# EAGLE design untitled (EAGLE 9.2.0)
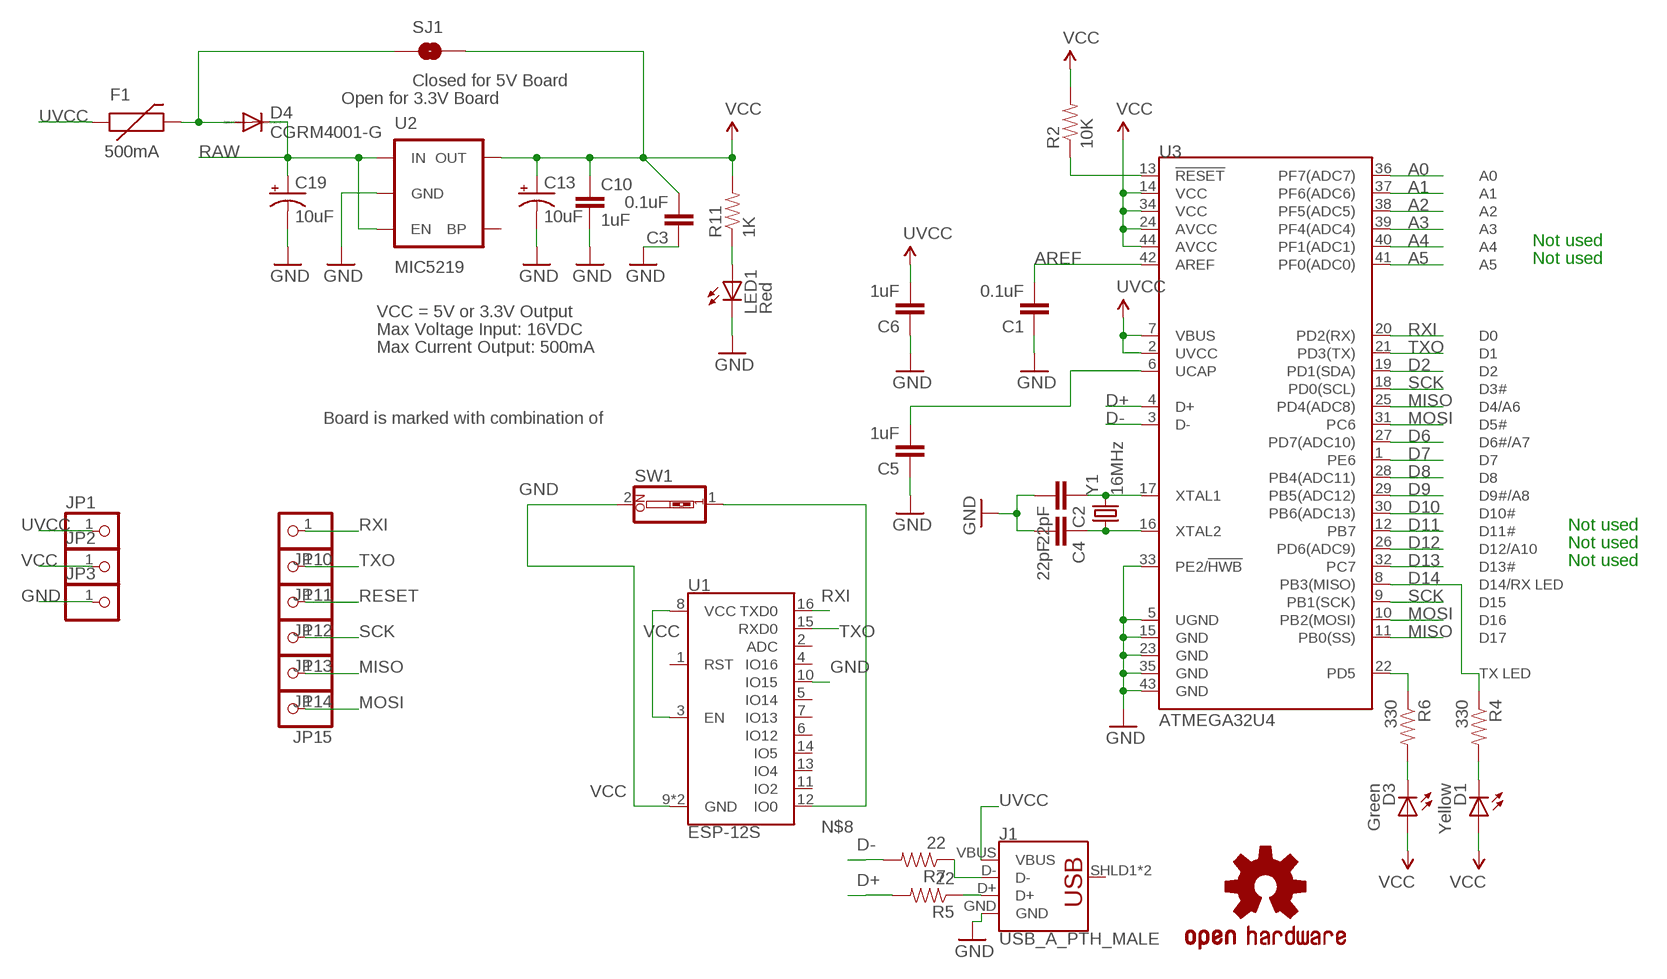
[diagram p0: schematic, sheet 1]

## Parts
C1  0.1uF  CAP0603-CAP  [0603-CAP]
C2  22pF  CAP0603-CAP  [0603-CAP]
C3  0.1uF  CAP0603-CAP  [0603-CAP]
C4  22pF  CAP0603-CAP  [0603-CAP]
C5  1uF  CAP0603-CAP  [0603-CAP]
C6  1uF  CAP0603-CAP  [0603-CAP]
C10  1uF  CAP0603-CAP  [0603-CAP]
C13  10uF  CAP_POL1206  [EIA3216]
C19  10uF  CAP_POL1206  [EIA3216]
D1  Yellow  LED0603  [LED-0603]
D3  Green  LED0603  [LED-0603]
D4  CGRM4001-G  [SOD-123_MINI-SMA]
F1  500mA  PTCSMD  [PTC-1206]
J1  USB_A_PTH_MALE  [USB-A-H]
JP1  PINHD-1X1  [1X01]
JP2  PINHD-1X1  [1X01]
JP3  PINHD-1X1  [1X01]
JP10  PINHD-1X1  [1X01]
JP11  PINHD-1X1  [1X01]
JP12  PINHD-1X1  [1X01]
JP13  PINHD-1X1  [1X01]
JP14  PINHD-1X1  [1X01]
JP15  PINHD-1X1  [1X01]
LED1  Red  LED0603  [LED-0603]
R2  10K  RESISTOR0603-RES  [0603-RES]
R4  330  RESISTOR0603-RES  [0603-RES]
R5  22  RESISTOR0603-RES  [0603-RES]
R6  330  RESISTOR0603-RES  [0603-RES]
R7  22  RESISTOR0603-RES  [0603-RES]
R11  1K  RESISTOR0603-RES  [0603-RES]
SJ1  Closed for 5V Board  SOLDERJUMPERNC  [SJ_2S]
SW1  SW_DIP-1  [EDG-01]
U1  ESP-12S  [ESP-12S]
U2  MIC5219  V_REG_LDOSMD  [SOT23-5]
U3  ATMEGA32U4  ATMEGA32U4OUTFAKES  [QFN-44-NOPAD_1:1-OUTFAKES]
U$3  OSHW-LOGOS  [OSHW-LOGO-S]
Y1  16MHz  CRYSTAL5X3  [CRYSTAL-SMD-5X3]

## Nets
A0: U3.36(PF7(ADC7))
A1: U3.37(PF6(ADC6))
A2: U3.38(PF5(ADC5))
A3: U3.39(PF4(ADC4))
A4: U3.40(PF1(ADC1))
A5: U3.41(PF0(ADC0))
AREF: C1.2 U3.42(AREF)
D2: U3.19(PD1(SDA))
D6: U3.27(PD7(ADC10))
D7: U3.1(PE6)
D8: U3.28(PB4(ADC11))
D9: U3.29(PB5(ADC12))
D10: U3.30(PB6(ADC13))
D11: U3.12(PB7)
D12: U3.26(PD6(ADC9))
D13: U3.32(PC7)
D14: R4.1 U3.8(PB3(MISO))
D+: R5.2 U3.4(D+)
D-: R7.2 U3.3(D-)
GND [vcc]: C1.1 C2.2 C3.1 C4.2 C5.1 C6.1 C10.2 C13.C(-) C19.C(-) J1.GND JP3.1 LED1.C SW1.2 U1.9(GND) U1.10(IO15) U1.P$1(GND) U2.2(GND) U3.5(UGND) U3.15(GND) U3.23(GND) U3.33(PE2/!HWB) U3.35(GND) U3.43(GND)
MISO: JP14.1 U3.11(PB0(SS)) U3.25(PD4(ADC8))
MOSI: JP15.1 U3.10(PB2(MOSI)) U3.31(PC6)
N$1: C4.1 U3.16(XTAL2) Y1.1
N$2: C2.1 U3.17(XTAL1) Y1.3
N$3: D4.A F1.2 SJ1.1
N$4: C5.2 U3.6(UCAP)
N$5: D1.C R4.2
N$7: D3.C R6.2
N$8: SW1.1 U1.12(IO0)
N$9: J1.D+ R5.1
N$10: J1.D- R7.1
N$38: LED1.A R11.1
RAW [vcc]: C19.A(+) D4.C U2.1(IN) U2.3(EN)
RESET: JP12.1 R2.1 U3.13(!RESET)
RXI: JP10.1 U1.16(TXD0) U3.20(PD2(RX))
SCK: JP13.1 U3.9(PB1(SCK)) U3.18(PD0(SCL))
TXLED: R6.1 U3.22(PD5)
TXO: JP11.1 U1.15(RXD0) U3.21(PD3(TX))
UVCC: C6.2 F1.1 J1.VBUS JP1.1 U3.2(UVCC) U3.7(VBUS)
VCC: C3.2 C10.1 C13.A(+) D1.A D3.A JP2.1 R2.2 R11.2 SJ1.2 U1.3(EN) U1.8(VCC) U2.5(OUT) U3.14(VCC) U3.24(AVCC) U3.34(VCC) U3.44(AVCC)
Unconnected: J1.SHLD1(SHIELD) J1.SHLD2(SHIELD) U1.1(RST) U1.2(ADC) U1.4(IO16) U1.5(IO14) U1.6(IO12) U1.7(IO13) U1.11(IO2) U1.13(IO4) U1.14(IO5) U2.4(BP)

## Notes on the sheet
- Open for 3.3V Board
- Not used
- Not used
- VCC = 5V or 3.3V Output
- Max Voltage Input: 16VDC
- Max Current Output: 500mA
- Board is marked with combination of
- Not used
- Not used
- Not used

## Library data of the parts
C1-C6 C10 = SparkFun:CAP: Capacitor Standard 0603 ceramic capacitor, and 0.1" leaded capacitor.
C13 C19 = SparkFun:CAP_POL: Capacitor Polarized These are standard SMD and PTH capacitors. Normally 10uF, 47uF, and 100uF in electrolytic and tantalum varieties. Always verify the external diameter of the through hole cap, it varies with capacity, voltage, and manufacturer. The EIA devices should be standard.
D1 D3 LED1 = SparkFun:LED: LEDs Standard schematic elements and footprints for 5mm, 3mm, 1206, and 0603 sized LEDs. 5mm - Spark Fun Electronics SKU : COM-00529 (and others)
D4 = diode:CGRM400*-G: Molded plasitc,JEDEC SOD-123/Mini SMA Source: Comchip CGRM4001-G.pdf
F1 = SparkFun:PTC: Resettable Fuse PTC Resettable Fuse. Spark Fun Electronics SKU : COM-08357
J1 = SparkFun-Connectors:USB_A: USB-A Connector Male and female variants, as well as PTH and SMT variants SparkFun Products: SparkFun XBee Explorer Dongle <https://www.sparkfun.com/products/11697> PTH Male SparkFun MicroView-USB Programmer <https://www.sparkfun.com/products/12924> SMT Male SparkFun USB Type A Female Breakout <https://www.sparkfun.com/products/12700> SMT Female; PROD_ID: CONN-08367; SF_ID: PRT-00437
JP1-JP3 JP10-JP15 = pinhead:PINHD-1X1: PIN HEADER
R2 R4-R7 R11 = SparkFun:RESISTOR: Resistor Basic schematic elements and footprints for 0603, 1206, and PTH resistors.
SJ1 = SparkFun:SOLDERJUMPER: Solder Jumper Standard SMD solder jumper. Used to automate production. Two varients : Normally Open and Normally Closed are the same, but have different paste layers. NC will have a large amount of paste and should jumper during reflow.; SPICEPREFIX: D
SW1 = special:SW_DIP-1: DIP SWITCH
U1 = SparkFun-RF:ESP-12S: AI-Thinker ESP-12S ESP-12S WiFi module is developed by AI-Thinker Co.,Ltd, core processor ESP8266 in smaller sizes of the module encapsulates Tensilica L106 integrates industry-leading ultra low power 32-bit MCU micro, with the 16-bit short mode, clock speed support 80 MHz, 160 MHz, supports the RTOS, integrated Wi-Fi MAC/BB/RF/PA/LNA, on-board antennas.; PROD_ID: IC-14115
U2 = SparkFun:V_REG_LDO: Voltage Regulator LDO Standard 150mA LDO voltage regulator in SOT-23 layout. Micrel part MIC5205. BP (by-pass) pin is used to lower output noise with 470pF cap.
U3 = Testing:ATMEGA32U4: Atmel 44-pin 8-bit Microcontroller with 32KBytes of ISP Flash and USB Controller
U$3 = SparkFun:OSHW-LOGO: Open Source Hardware Logo This logo indicates the piece of hardware it is found on incorporates a OSHW license and/or adheres to the definition of open source hardware found here: http://freedomdefined.org/OSHW
Y1 = SparkFun:CRYSTAL: Crystals Various standard crystals. Proven footprints. Spark Fun Electronics SKU : COM-00534

## Net classes
0 default: width 0.203 mm

## Board
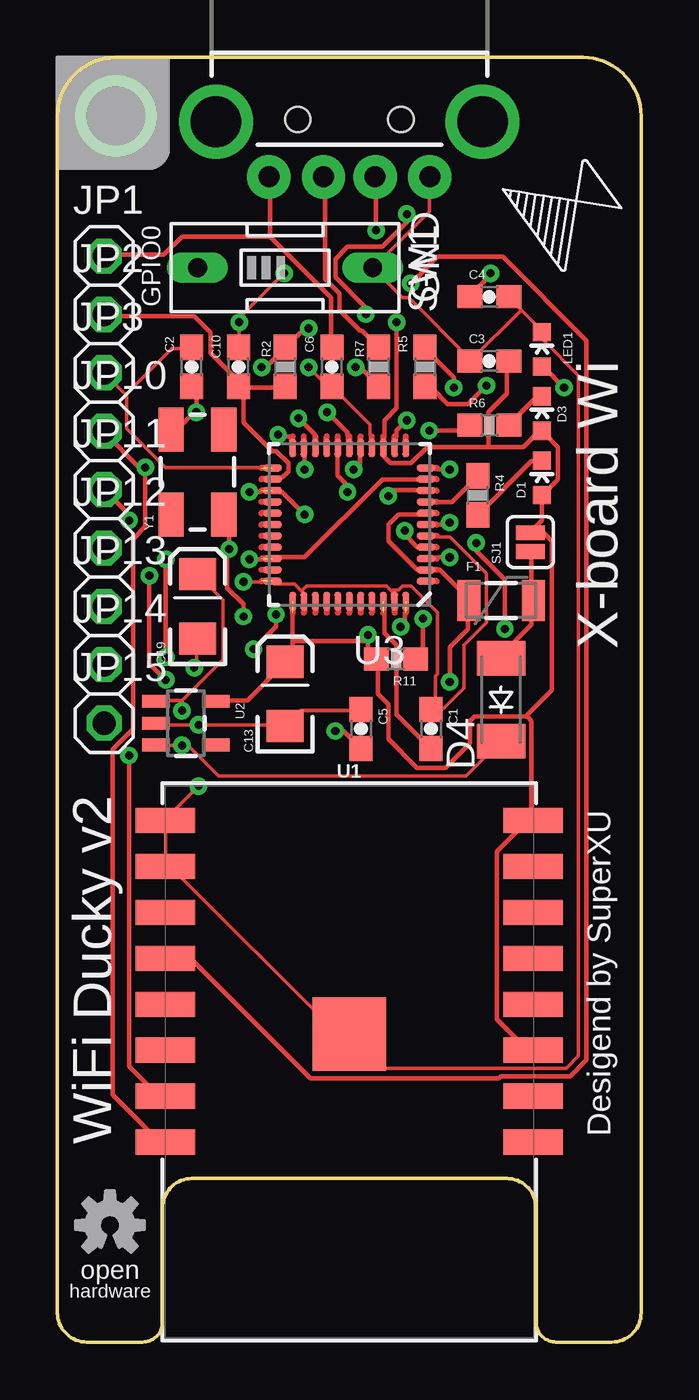
[diagram p1: board, top side]
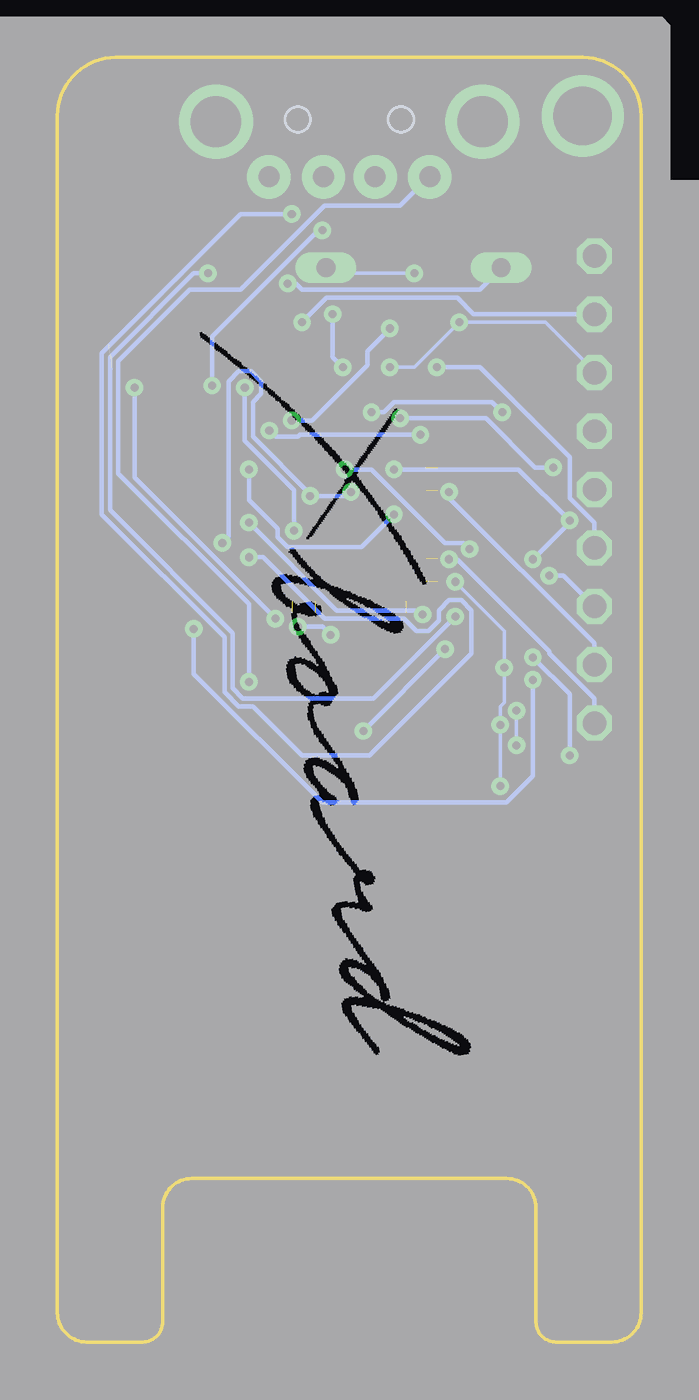
[diagram p2: board, bottom side, seen from below]

Size 25.4 x 55.88 mm. Coordinates in mm from the lower left corner, seen from the top.
Outline: 25.4,1.27 25.4,53.34 arc90 22.86,55.88 2.54,55.88 arc90 0,53.34 0,1.27 arc90 1.27,0 3.71,0 arc90 4.57,0.87 4.57,5.84 arc-90 5.84,7.11 19.56,7.11 arc-90 20.83,5.84 20.83,0.87 arc90 21.7,0 24.13,0 arc90 25.4,1.27
Copper layers (1*16): Top 0.035mm / dielectric 1.5mm / Bottom 0.035mm
Design rules "default *": minimum track width 6mil, minimum drill 0.35mm, track to track 6mil, track to pad 6mil, pad to pad 6mil, via to via 6mil, smd to smd 6mil, copper to edge 40mil, drill to drill 6mil, minimum pad ring 10mil, minimum via ring 8mil, stop-mask expansion 4mil, vias tented up to drill 0.35mm, thermal gap 10mil

### Footprints (pad centres in the part's own frame; a part is rotated, then mirrored left to right if it is on the bottom)
0603-CAP = smd 1.1 x 1: 1 -0.85,0; 2 0.85,0
EIA3216 = smd 1.4 x 1.6: A 1.4,0; C -1.4,0
LED-0603 = smd 0.8 x 0.8: A 0,-0.75; C 0,0.75
SOD-123_MINI-SMA = smd 1.5 x 2.1: A 1.8,0; C -1.8,0
PTC-1206 = smd 1 x 1.8: 1 -1.4,0; 2 1.4,0
USB-A-H = drill 0.914 pad 1.88: D+ 2.4,1.127; D- 2.4,-1.127; GND 2.4,3.5; VBUS 2.4,-3.5 | drill 2.2: SHLD1 0,-5.8; SHLD2 0,5.8 | hole 1.1: -0.1,2.25; -0.1,-2.25
1X01 = drill 1.016 octagon: 1 0,0
0603-RES = smd 1.1 x 1: 1 -0.85,0; 2 0.85,0
SJ_2S = smd 0.635 x 1.27: 1 -0.412,0; 2 0.412,0
EDG-01 = drill 0.813 long: 1 0,-3.81; 2 0,3.81
ESP-12S = smd 2.6 x 1.1: 1 -8,3.5; 2 -8,1.5; 3 -8,-0.5; 4 -8,-2.5; 5 -8,-4.5; 6 -8,-6.5; 7 -8,-8.5; 8 -8,-10.5; 9 8,-10.5; 10 8,-8.5; 11 8,-6.5; 12 8,-4.5; 13 8,-2.5; 14 8,-0.5; 15 8,1.5; 16 8,3.5 | smd 3.2 x 3.2: P$1 0,-1.2
SOT23-5 = smd 0.55 x 1.2: 1 -0.95,-1.3; 2 0,-1.3; 3 0.95,-1.3; 4 0.95,1.3; 5 -0.95,1.3
QFN-44-NOPAD_1:1-OUTFAKES = smd 0.8 x 0.3: 1 -3.337,2.465; 2 -3.337,1.972; 3 -3.337,1.479; 4 -3.337,0.986; 5 -3.337,0.493; 6 -3.337,0; 7 -3.337,-0.493; 8 -3.337,-0.986; 9 -3.337,-1.479; 10 -3.337,-1.972; 11 -3.337,-2.465; 23 3.337,-2.465; 24 3.337,-1.972; 25 3.337,-1.479; 26 3.337,-0.986; 27 3.337,-0.493; 28 3.337,0; 29 3.337,0.493; 30 3.337,0.986; 31 3.337,1.479; 32 3.337,1.972; 33 3.337,2.465 | smd 0.3 x 0.8: 12 -2.465,-3.337; 13 -1.972,-3.337; 14 -1.479,-3.337; 15 -0.986,-3.337; 16 -0.493,-3.337; 17 0,-3.337; 18 0.493,-3.337; 19 0.986,-3.337; 20 1.479,-3.337; 21 1.972,-3.337; 22 2.465,-3.337; 34 2.465,3.337; 35 1.972,3.337; 36 1.479,3.337; 37 0.986,3.337; 38 0.493,3.337; 39 0,3.337; 40 -0.493,3.337; 41 -0.986,3.337; 42 -1.479,3.337; 43 -1.972,3.337; 44 -2.465,3.337
CRYSTAL-SMD-5X3 = smd 1.9 x 1.1: 1 -1.85,-1.15; 2 1.85,-1.15; 3 1.85,1.15; 4 -1.85,1.15

### Placement (x,y rotation side)
C1  16.26,26.67 270 top
C2  5.84,42.42 90 top
C3  18.8,42.67 0 top
C4  18.8,45.47 0 top
C5  13.21,26.67 270 top
C6  11.94,42.42 90 top
C10  7.87,42.42 90 top
C13  9.91,28.19 90 top
C19  6.1,32 90 top
D1  21.08,37.59 0 top
D3  21.08,40.39 0 top
D4  19.3,27.94 90 top
F1  19.3,32.26 0 top
J1  12.7,53.09 270 top
JP1  2.03,47.24 0 top
JP2  2.03,44.7 0 top
JP3  2.03,42.16 0 top
JP10  2.03,39.62 0 top
JP11  2.03,37.08 0 top
JP12  2.03,34.54 0 top
JP13  2.03,32 0 top
JP14  2.03,29.46 0 top
JP15  2.03,26.92 0 top
LED1  21.08,43.18 0 top
R2  9.91,42.42 270 top
R4  18.29,36.83 270 top
R5  16,42.42 90 top
R6  18.8,39.88 0 top
R7  13.97,42.42 270 top
R11  14.73,29.72 180 top
SJ1  20.57,34.8 90 top
SW1  9.91,46.74 270 top
U1  12.7,12.19 180 top
U2  5.59,26.92 270 top
U3  12.7,35.56 180 top
U$3  2.29,5.08 0 top
Y1  6.1,37.85 90 top

### Tracks (layer width: path | path; a pad name or v marks a point on that pad's centre or on a via)
AREF  (1 unrouted)
  Top 0.203: 14.18,31.73 14.22,31.65 14.22,30.85 14.76,30.32 14.76,27.29 16.18,25.87 C1.2
D14
  Top 0.203: U3.8 16.62,36.54 17.16,36.54 18.22,37.6 R4.1
D+  (via drill 0.35)
  Top 0.203: v15.11,35.29 15.11,35.12 15.65,34.58 15.91,34.58 U3.4 | v17.25,41.52 17.25,41.96 16,43.2 R5.2
  Bottom 0.203: v15.11,35.29 15.11,37.07 17.25,39.2 v17.25,41.52
D-  (via drill 0.35)
  Top 0.203: v17.07,34.14 16.62,34.14 U3.3 | v15.2,49.07 15.2,48.72 14.13,47.65 12.62,47.65 12.09,47.12 12.09,46.32 13.42,44.98 v13.42,44.72 | v12.98,42.41 13.16,42.41 13.96,41.6 R7.2
  Bottom 0.203: v17.07,34.14 16.45,34.14 13.78,31.47 10.31,31.47 9.78,30.94 9.25,30.94 8.8,31.38 8.8,31.83 8.36,32.27 7.82,32.27 7.38,31.83 7.38,29.96 11.82,25.51 14.76,25.51 16.89,27.65 17.51,27.65 18.14,28.27 18.14,30.67 23.47,36.01 23.47,43.03 17.42,49.07 v15.2,49.07 | v13.42,44.72 13.42,42.85 v12.98,42.41
GND  (via drill 0.35)  (2 unrouted)
  Top 0.152: U3.15 13.6,39.47 13.6,39.92 12,41.52 C6.1 11.91,41.6 11.73,41.6 v10.94,42.41 | 2.98,41.2 2.04,42.14 JP3.1 | 2.98,41.2 3.02,41.16 3.02,39.74 4.71,38.05 8.8,38.05 8.87,38.02 | 2.98,41.2 4.98,43.2 5.78,43.2 C2.2 | C10.2 7.91,43.29 v7.91,44.36 7.91,44.54 v9.87,46.49 | 20.18,44.9 19.65,45.43 C4.2 | 20.18,44.9 21.07,44.01 LED1.C 21.16,43.92 21.16,43.56 22.67,42.05 22.67,12.45 22.14,11.91 14.13,11.91 12.71,13.34 U1.P$1 12.62,13.42 12.18,13.42 4.98,20.62 4.71,20.62 U1.10 4.71,20.71 4.71,22.67 U1.9 4.71,22.76 v6.13,24.18 | 20.18,44.9 C3.1 17.96,42.76 15.29,45.43 15.02,45.43 SW1.2 13.78,46.76 16.18,49.16 16.18,50.67 J1.GND | 10.62,32.67 10.31,32.98 9.42,32.98 U3.33 | 10.62,32.67 10.67,32.63 10.67,32.27 U3.35 | 14.54,32.67 14.31,32.89 10.85,32.89 10.62,32.67 | 14.54,32.67 14.58,32.63 14.58,32.27 U3.43 | 16.45,27.56 16.27,27.56 C1.1 16.45,27.56 | 16.45,27.56 16.8,27.56 17.69,28.45 17.69,30.32 18.67,31.29 18.67,33.43 17.07,35.03 16.62,35.03 U3.5 | 16.45,27.56 16.45,28.98 16.54,29.07 16.54,31.74 15.38,32.89 15.02,32.89 14.85,32.72 14.58,32.72 14.54,32.67 | C5.1 13.16,27.47 10.58,27.47 9.96,26.85 C13.C 9.87,26.85 v6.13,26.85 4.36,26.85 U2.2 | v5.96,29.34 6.04,29.43 6.04,30.58 C19.C | v8.09,33.07 8.8,33.07 8.87,33.09
  Bottom 0.152: JP3.1 2.04,42.23 4.18,44.36 v7.91,44.36 9.87,42.41 v10.94,42.41 | v9.87,46.49 13.51,46.49 13.69,46.67 SW1.2 | v6.13,24.18 v6.13,26.85 6.13,27.65 5.96,27.83 v5.96,29.34 5.96,30.94 v8.09,33.07
MISO  (via drill 0.35)  (1 unrouted)
  Top 0.203: v17.07,37.96 16.62,37.96 U3.11 | v10.76,36.01 9.78,36.98 9.42,36.98 U3.25 | v8.36,36.98 8.8,36.98 8.87,37.04
  Bottom 0.203: v17.07,37.96 17.07,36.63 15.82,35.38 15.82,35.03 15.38,34.58 12.18,34.58 v10.76,36.01 | v8.36,36.98 8.36,36.72 2.04,30.4 2.04,29.52 JP14.1
MOSI  (via drill 0.35)  (1 unrouted)
  Top 0.203: U3.10 15.91,37.52 14.13,37.52 10.76,34.14 9.42,34.14 U3.31 | v8.36,34.05 8.8,34.05 8.87,34.08
  Bottom 0.203: v8.36,34.05 8,34.05 4,30.05 4,29.96 2.04,28 2.04,26.94 JP15.1
N$1  (via drill 0.35)
  Top 0.203: v12.89,37.96 13.16,38.23 13.16,38.85 U3.16 | Y1.1 7.29,35.92 7.47,35.74 v7.47,34.49 7.38,34.49 7.38,32.8 8.09,32.09 v8.09,31.56 | v18.85,46.49 18.85,46.41 17.96,45.52 C4.1
  Bottom 0.203: v12.89,37.96 11.73,37.96 8.53,34.76 7.73,34.76 v7.47,34.49 | v18.85,46.49 19.47,46.49 23.11,42.85 23.11,36.18 17.78,30.85 17.78,28.45 17.34,28 11.65,28 v8.09,31.56
N$2  (via drill 0.35)
  Top 0.203: v11.73,40.45 12.62,39.56 12.62,39.47 U3.17 | C2.1 5.87,41.52 6.04,41.34 v6.04,40.45 5.96,40.45 5.25,39.74 4.98,39.74 Y1.3
  Bottom 0.203: v11.73,40.45 11.2,40.45 10.76,40.89 6.49,40.89 v6.04,40.45
N$3
  Top 0.203: SJ1.1 20.62,34.31 20.62,32.27 F1.2 20.62,32.18 20.62,31.2 19.38,29.96 19.38,29.78 D4.A
N$4  (via drill 0.35)
  Top 0.203: v17.07,35.65 16.98,35.56 U3.6 | v9.51,31.65 9.51,31.11 v8.53,30.14 | v12.09,26.58 12.45,26.58 13.16,25.87 C5.2
  Bottom 0.203: v17.07,35.65 13.25,31.83 9.69,31.83 v9.51,31.65 | v12.09,26.58 v8.53,30.14
N$5
  Top 0.203: D1.C 21.07,38.32 20.62,38.32 18.31,36.01 R4.2
N$6  (via drill 2.54)
  other vias: 2.54,53.34
N$7
  Top 0.203: D3.C 21.07,41.07 20.8,41.07 19.65,39.92 R6.2
N$8  (via drill 0.35)
  Top 0.203: v15.38,46.05 16.54,47.21 19.38,47.21 23.02,43.56 23.02,12.27 22.31,11.56 19.29,11.56 19.2,11.47 11.02,11.47 5.87,16.62 4.71,16.62 U1.12
  Bottom 0.203: v15.38,46.05 15.02,46.05 14.76,45.78 7.02,45.78 6.13,46.67 SW1.1
N$9  (via drill 0.35)
  Top 0.203: v18.67,41.6 17.87,40.8 16.98,40.8 16.27,41.52 16,41.52 R5.1 | v13.87,48.36 13.87,50.67 J1.D+
  Bottom 0.203: v18.67,41.6 18.67,43.74 14.05,48.36 v13.87,48.36
N$10
  Top 0.203: R7.1 13.96,43.29 13.25,44.01 13.16,44.01 12.27,44.9 12.27,45.61 11.65,46.23 11.65,50.67 J1.D-
N$38  (via drill 0.35)
  Top 0.203: v22.05,41.52 21.16,42.41 LED1.A | v15.91,31.47 15.91,30.05 15.65,29.78 R11.1
  Bottom 0.203: v22.05,41.52 22.05,37.6 v15.91,31.47
RAW  (via drill 0.35)
  Top 0.152: 5.42,27.91 4.36,27.91 U2.1 | 5.42,27.91 7.2,29.69 7.2,32.27 6.13,33.34 C19.A | U2.3 4.36,25.96 v5.42,25.96 5.69,25.96 7.02,24.62 17.78,24.62 D4.C | v5.42,27.47 5.42,27.91
  Bottom 0.152: v5.42,25.96 v5.42,27.47
RESET  (via drill 0.35)
  Top 0.203: v15.2,40.09 14.76,39.65 14.76,39.47 U3.13 | v10.94,44.09 10.76,44.09 9.96,43.29 R2.1 9.87,43.2 9.07,42.41 v8.89,42.41
  Bottom 0.203: v15.2,40.09 14.31,40.09 11.91,42.49 11.91,43.12 v10.94,44.09 | v8.89,42.41 7.02,42.41 3.11,38.49 3.11,36.72 2.04,35.65 2.04,34.58 JP12.1
RXI  (via drill 0.35)
  Top 0.203: v10.49,40.18 11.2,39.47 U3.20 | JP10.1 2.04,39.56 3.56,38.05 v3.82,38.05 3.82,35.47 3.29,34.94 3.29,26.67 2.4,25.78 2.4,10.76 4.45,8.71 4.62,8.71 U1.16
  Bottom 0.203: v10.49,40.18 6.76,40.18 4.62,38.05 v3.82,38.05
SCK  (via drill 0.35)
  Top 0.203: v14.4,36.8 14.67,37.07 15.91,37.07 U3.9 | v12.62,36.98 12.62,37.25 12.18,37.69 12.18,38.85 U3.18 | v18.22,34.76 18.22,34.4 19.47,33.16 v19.47,31.03 | v4.71,28.8 4,29.52 v4,33.34
  Bottom 0.203: v12.62,36.98 12.8,36.8 v14.4,36.8 14.4,36.89 16.89,39.38 16.89,40.89 16.54,41.25 16.54,41.78 16.98,42.23 17.51,42.23 17.96,41.78 17.96,35.03 v18.22,34.76 | v19.47,31.03 19.47,29.07 13.87,23.47 5.87,23.47 4.71,24.62 v4.71,28.8 | v4,33.34 3.38,33.34 2.04,32 JP13.1
TXLED  (via drill 0.35)
  Top 0.203: v9.6,39.47 9.69,39.38 10.13,39.38 U3.22 | v16.18,39.65 17.69,39.65 17.87,39.83 R6.1
  Bottom 0.203: v9.6,39.47 14.85,39.47 14.94,39.38 15.91,39.38 v16.18,39.65
TXO  (via drill 0.35)
  Top 0.203: v10.76,37.96 10.76,38.85 U3.21 | v3.11,35.74 3.11,36.01 JP11.1 | v3.11,25.51 3.11,12 4.36,10.76 4.62,10.76 U1.15 | v4.71,34.05 v4.71,29.78
  Bottom 0.203: v10.76,37.96 5.33,37.96 v3.11,35.74 3.11,35.65 v4.71,34.05 | v3.11,25.51 3.11,28.18 v4.71,29.78
UVCC  (via drill 0.35)
  Top 0.203: U3.7 15.91,36.01 14.85,36.01 14.4,35.56 14.4,34.85 15.65,33.6 15.91,33.6 U3.2 16.62,33.6 17.96,32.27 F1.1 17.87,32.18 17.87,31.03 17.07,30.23 v17.07,28.71 | 9.25,48.09 11.91,45.43 11.91,43.29 C6.2 | 9.25,48.09 9.25,50.67 J1.VBUS | 9.25,48.09 5.42,48.09 4.62,47.3 2.04,47.3 JP1.1
  Bottom 0.203: v17.07,28.71 17.07,32.09 22.76,37.78 22.76,42.67 19.65,45.78 17.42,45.78 13.78,49.43 10.49,49.43 9.25,50.67 J1.VBUS
VCC  (via drill 0.35)  (2 unrouted)
  Top 0.203: U3.24 9.42,37.6 9.78,37.6 10.05,37.87 10.05,38.23 9.51,38.76 9.34,38.76 8.09,40.01 8.09,41.34 7.91,41.52 C10.1 | R2.2 9.87,41.52 8.36,41.52 8.18,41.34 C10.1 | C10.1 7.82,41.6 7.82,41.87 6.67,43.03 6.67,43.92 5.96,44.63 2.04,44.63 JP2.1 | 18.76,38.94 20.27,38.94 20.98,39.65 D3.A 21.16,39.56 21.78,38.94 21.78,37.52 21.16,36.89 D1.A 21.07,36.8 21.07,35.74 20.62,35.29 SJ1.2 20.89,35.47 21.51,34.85 21.51,28.36 20.45,27.29 20.45,27.2 | 18.76,38.94 16.09,38.94 15.38,38.23 14.49,38.23 14.22,38.49 14.22,38.85 U3.14 14.22,39.47 14.22,40.09 14.76,40.63 v14.76,44.36 | 18.76,38.94 18.76,40.45 19.56,41.25 19.56,42.67 C3.2 | v14.94,31.11 15.11,31.29 15.11,31.65 15.16,31.73 | 10.22,30.49 10.22,29.87 9.96,29.6 C13.A 9.87,29.52 8.27,27.91 6.93,27.91 U2.5 | 10.22,30.49 10.22,31.65 10.23,31.73 | 10.22,30.49 13.42,30.49 v13.51,30.76 13.51,30.14 13.87,29.78 R11.2 13.96,29.69 13.96,28.18 14.4,27.74 14.4,26.23 15.65,24.98 16.89,24.98 17.96,26.05 17.96,27.03 18.14,27.2 20.45,27.2 | U1.3 20.62,12.71 20.45,12.71 19.11,14.05 19.11,21.34 20.45,22.67 20.62,22.67 U1.8 20.62,22.76 20.62,27.03 20.45,27.2
  Bottom 0.203: v14.94,31.11 13.87,31.11 v13.51,30.76 | v14.76,44.36 13.69,45.43 8,45.43 7.29,44.72 2.04,44.72 JP2.1

### Text on the board
tPlace: GPIO0 | GND | X-board Wi | Desigend by SuperXU | WiFi Ducky v2 | open | hardware
bPlace: K:/Desktop/格式工厂1206 (1).bmp